# Altium project USB-RS485-unit.PrjPcb
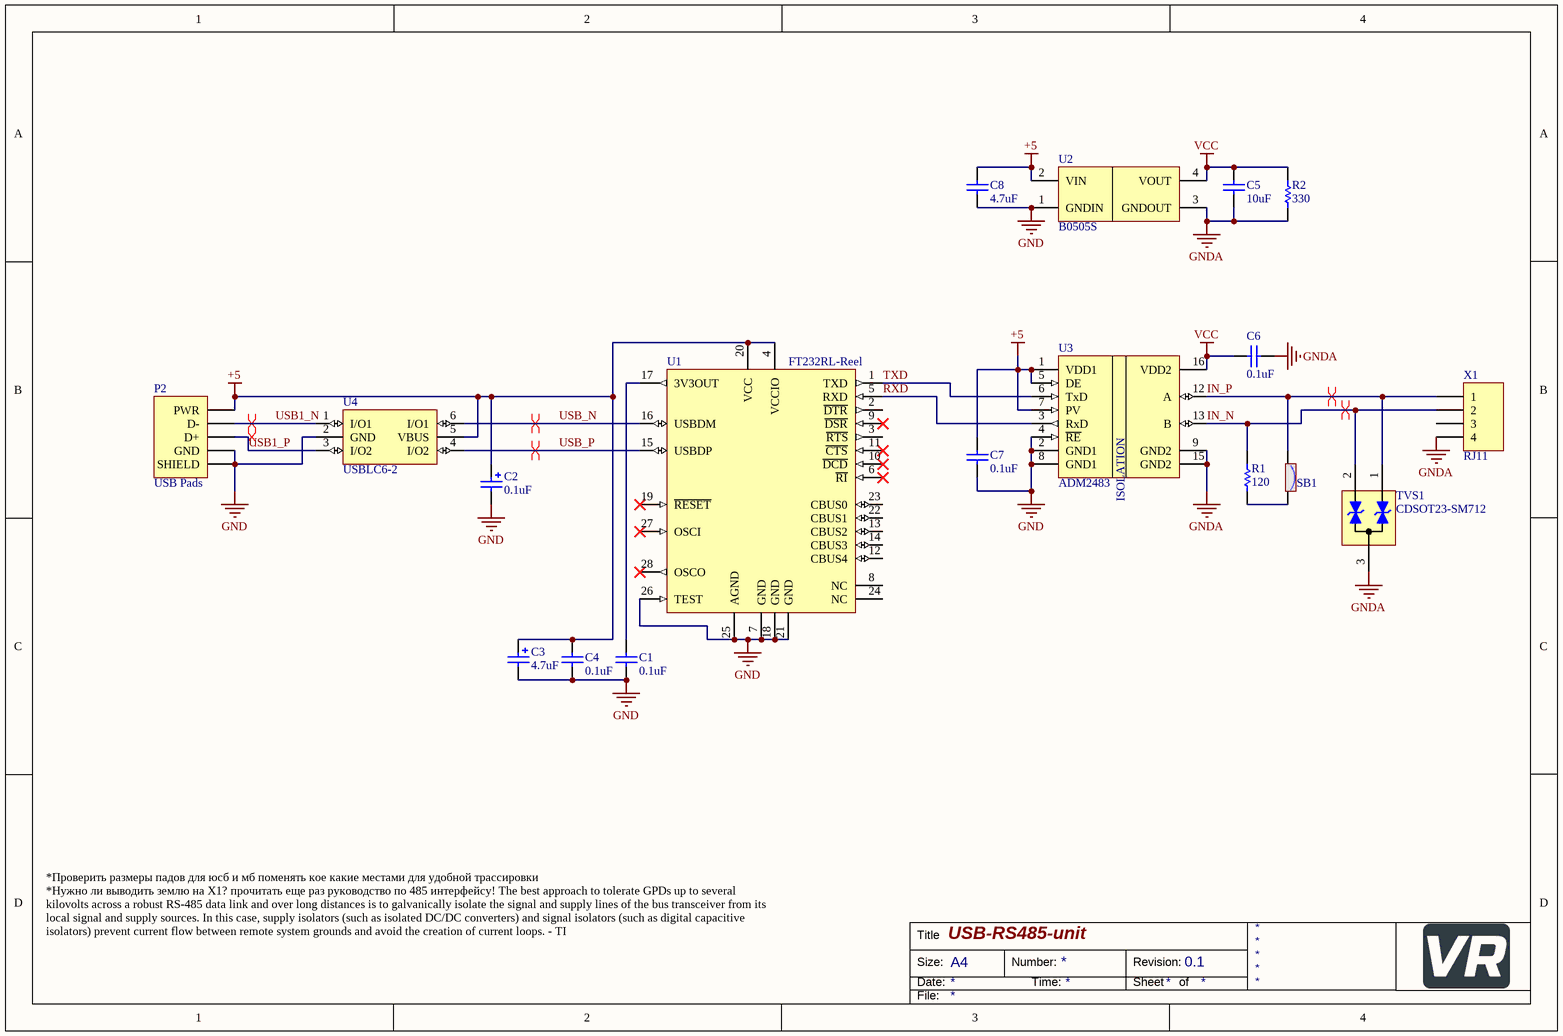
[diagram p0: USB-RS485-unit.SchDoc]
1 sheet, 18 parts. Net scope: global (net labels, ports and power ports of the same name join across sheets).
Board file: USB-RS485-unit.PcbDoc

## Sheet USB-RS485-unit.SchDoc: USB-RS485-unit
size A4; Revision: 0.1

### Parts
C1  0.1uF  [C1206]
C2  0.1uF  [TC3216-1206]
C3  4.7uF  [TC3216-1206]
C4  0.1uF  [C1206]
C5  10uF  [C1206]
C6  0.1uF  [C1206]
C7  0.1uF  [C1206]
C8  4.7uF  [C1206]
P2  USB Pads  [USB soldering pads]  (no BOM)
R1  120  [RES-0805]
R2  330  [RES-0805]
SB1  SB_OFF  [SOLDER-BRIDGE-R0603-0R]  (value not drawn)  (no BOM)
TVS1  CDSOT23-SM712  [SOT-23B_N]
U1  FT232RL-Reel  [SSOP-28_L]
U2  B0505S  [B0505S - horizontal]
U3  ADM2483  [SOL-16 Wide]
U4  USBLC6-2  [SOT23-6]
X1  RJ11  [RJ11]

### Nets
+5: C2.1 C3.1 C4.2 C7.2 C8.2 P2.1(PWR) U1.4(VCCIO) U1.20(VCC) U2.2(VIN) U3.1(VDD1) U3.5(DE) U3.7(PV) U4.5(VBUS)
GND: C1.1 C2.2 C3.2 C4.1 C7.1 C8.1 P2.4(GND) P2.5(SHIELD) U1.7(GND) U1.18(GND) U1.21(GND) U1.25(AGND) U1.26(TEST) U2.1(GNDIN) U3.2(GND1) U3.4(~{RE}) U3.8(GND1) U4.2(GND)
GNDA: C5.1 C6.1 R2.1 TVS1.3 U2.3(GNDOUT) U3.9(GND2) U3.15(GND2) X1.4
VCC: C5.2 C6.2 R2.2 U2.4(VOUT) U3.16(VDD2)
IN_N: R1.2 TVS1.2 U3.13(B) X1.2
IN_P: SB1.1 TVS1.1 U3.12(A) X1.1
RXD: U1.5(RXD) U3.3(RxD)
TXD: U1.1(TXD) U3.6(TxD)
USB1_N: P2.2(D-) U4.1(I/O1)
USB1_P: P2.3(D+) U4.3(I/O2)
USB_N: U1.16(USBDM) U4.6(I/O1)
USB_P: U1.15(USBDP) U4.4(I/O2)
NetC1_2: C1.2 U1.17(3V3OUT)
NetR1_1: R1.1 SB1.2

Not connected (* = marked no-connect by the designer): U1 2(~{DTR}) 3(~{RTS}) 6(~{RI})* 8(NC) 9(~{DSR})* 10(~{DCD})* 11(~{CTS})* 12(CBUS4) 13(CBUS2) 14(CBUS3) 19(~{RESET})* 22(CBUS1) 23(CBUS0) 24(NC) 27(OSCI)* 28(OSCO)*; X1 3

### Layout directives
differential pair; differential pair class 1: USB_N, USB_P
differential pair; differential pair class 2: USB1_N, USB1_P
differential pair; differential pair class 3: IN_N, IN_P

### Notes on the sheet
- *Проверить размеры падов для юсб и мб поменять кое какие местами для удобной трассировки
  *Нужно ли выводить землю на Х1? прочитать еще раз руководство по 485 интерфейсу! The best approach to tolerate GPDs up to several kilovolts across a robust RS-485 data link and over long distances is to galvanically isolate the signal and supply lines of the bus transceiver from its local signal and supply sources. In this case, supply isolators (such as isolated DC/DC converters) and signal isolators (such as digital capacitive isolators) prevent current flow between remote system grounds and avoid the creation of current loops. - TI
- Title
- Size:
- Date:
- A4
- Number:
- Time:
- Revision:
- Sheet
- of
- File:
- (in symbol ADM2483) ISOLATION

### Library data of the parts
C1 C4 C6 C7 = Cap: Capacitor ceramic SMT; Manufacturer_Part_Number: GRM319R71H104K; Manufacturer: Murata; Part_Type: Chip Capacitor; Order_Code_ChipIDip: 348319975; Value: 0.1uF
C2 = Cap Polarized: Polarized Capacitor SMT; Manufacturer: TECAP; Manufacturer_Part_Number: TECAP0.1/35VA10; Order_Code_ChipIDip: 1654; Part_Type: Polarized Capacitor; Value: 0.1uF
C3 = Cap Polarized: Polarized Capacitor SMT; Manufacturer: TECAP; Manufacturer_Part_Number: TECAP4.7/10VA10; Order_Code_ChipIDip: 6038; Part_Type: Polarized Capacitor; Value: 4.7uF
C5 = Cap: Capacitor ceramic SMT; Manufacturer_Part_Number: GRM31A7U3A100JW31D; Manufacturer: Murata; Part_Type: Chip Capacitor; Order_Code_ChipIDip: 9000122773; Value: 10uF
C8 = Cap: Capacitor ceramic SMT; Manufacturer_Part_Number: GRM31CR71E475KA88L; Manufacturer: Murata; Part_Type: Chip Capacitor; Order_Code_ChipIDip: 9000122604; Value: 4.7uF
P2 = USB pads: Pads for soldering USB cable; Part_Type: Mechanical; Value: USB Pads
R1 = Res: Rectangular Thick Film Chip Resistor; Manufacturer: Yageo; Manufacturer_Part_Number: RC0805FR-07120RL; Order_Code_ChipIDip: 9000079464; ComponentLink1Description: Manufacturer Link; ComponentLink1URL: http://www.panasonic.com/industrial/components/resistive_products.htm; ComponentLink2Description: Datasheet; ComponentLink2URL: http://www.panasonic.com/industrial/components/pdf/AOA0000CE8.pdf; Value: 120; Part_Type: Resistor
R2 = Res: Rectangular Thick Film Chip Resistor; Manufacturer: Yageo; Manufacturer_Part_Number: RC0805FR-07330RL; Order_Code_ChipIDip: 9000079474; ComponentLink1Description: Manufacturer Link; ComponentLink1URL: http://www.panasonic.com/industrial/components/resistive_products.htm; ComponentLink2Description: Datasheet; ComponentLink2URL: http://www.panasonic.com/industrial/components/pdf/AOA0000CE8.pdf; Value: 330; Part_Type: Resistor
SB1 = SB_OFF: Solder Bridge OFF; Part_Type: Mechanical; ComponentLink1Description: Datasheet
TVS1 = CDSOT23-SM712: Surface Mount TVS Diode; Manufacturer: Bourns; Order_Code_ChipIDip: 9000168919; Manufacturer_Part_Number: CDSOT23-SM712; ComponentLink1Description: Datasheet; Part_Type: TVS; ComponentLink1URL: http://tunmcdsvn.tun.st.com/Component_Datasheet_Library/Trunk/Diodes/STM_ESD_ESDA6V1BC6; Package: SOT-23; Value: CDSOT23-SM712
U1 = FT232RL-Reel: USB UART Asynchronous Serial Data Transfer Chip, SSOP-28, Tape and Reel; Part_Type: Driver; Manufacturer: FTDI; Order_Code_ChipIDip: 201330607; Value: FT232RL-Reel; Manufacturer_Part_Number: FT232RL-Reel; ComponentLink1Description: Manufacturer Link; ComponentLink1URL: http://www.ftdichip.com/Products/ICs/FT232R.htm; ComponentLink2Description: Datasheet; ComponentLink2URL: http://www.ftdichip.com/Support/Documents/DataSheets/ICs/DS_FT232R.pdf
U2 = B0505S: Isolated DC-DC Converter; Manufacturer_Part_Number: B0505S-1WR2; Manufacturer: Mornsun Power; Order_Code_ChipIDip: 9000304516; ComponentLink1Description: Datasheet; Part_Type: DC-DC; ComponentLink1URL: http://tunmcdsvn.tun.st.com/Component_Datasheet_Library/Trunk/Diodes/STM_ESD_ESDA6V1BC6; Package: SIP; Value: B0505S
U3 = ADM2483: Half-Duplex, Isolated RS-485 Transceiver; Manufacturer_Part_Number: ADM2483BRWZ-REEL; Manufacturer: STMICROELECTRONICS; Order_Code_ChipIDip: 9000375326; ComponentLink1Description: Datasheet; Part_Type: Transceiver; ComponentLink1URL: http://tunmcdsvn.tun.st.com/Component_Datasheet_Library/Trunk/Diodes/STM_ESD_ESDA6V1BC6; Package: SOIC-W; Value: ADM2483
U4 = USBLC6-2: Quad Bidir ESD protection; Manufacturer: STMICROELECTRONICS; Manufacturer_Part_Number: USBLC6-2SC6; Order_Code_ChipIDip: 9000039051; ComponentLink1Description: Datasheet; Status: Released; Part_Type: ESD Protection; ComponentLink1URL: http://tunmcdsvn.tun.st.com/Component_Datasheet_Library/Trunk/Diodes/STM_ESD_ESDA6V1BC6; Value: USBLC6-2
X1 = RJ11: RJ-11 Connector, 4-Pin; Manufacturer_Part_Number: DS1132-S40BPX; Manufacturer: Connfly; Order_Code_ChipIDip: 9000190984; Value: RJ11; Part_Type: Connector